# Altium schematic sheet Sheet2.SchDoc
size A3
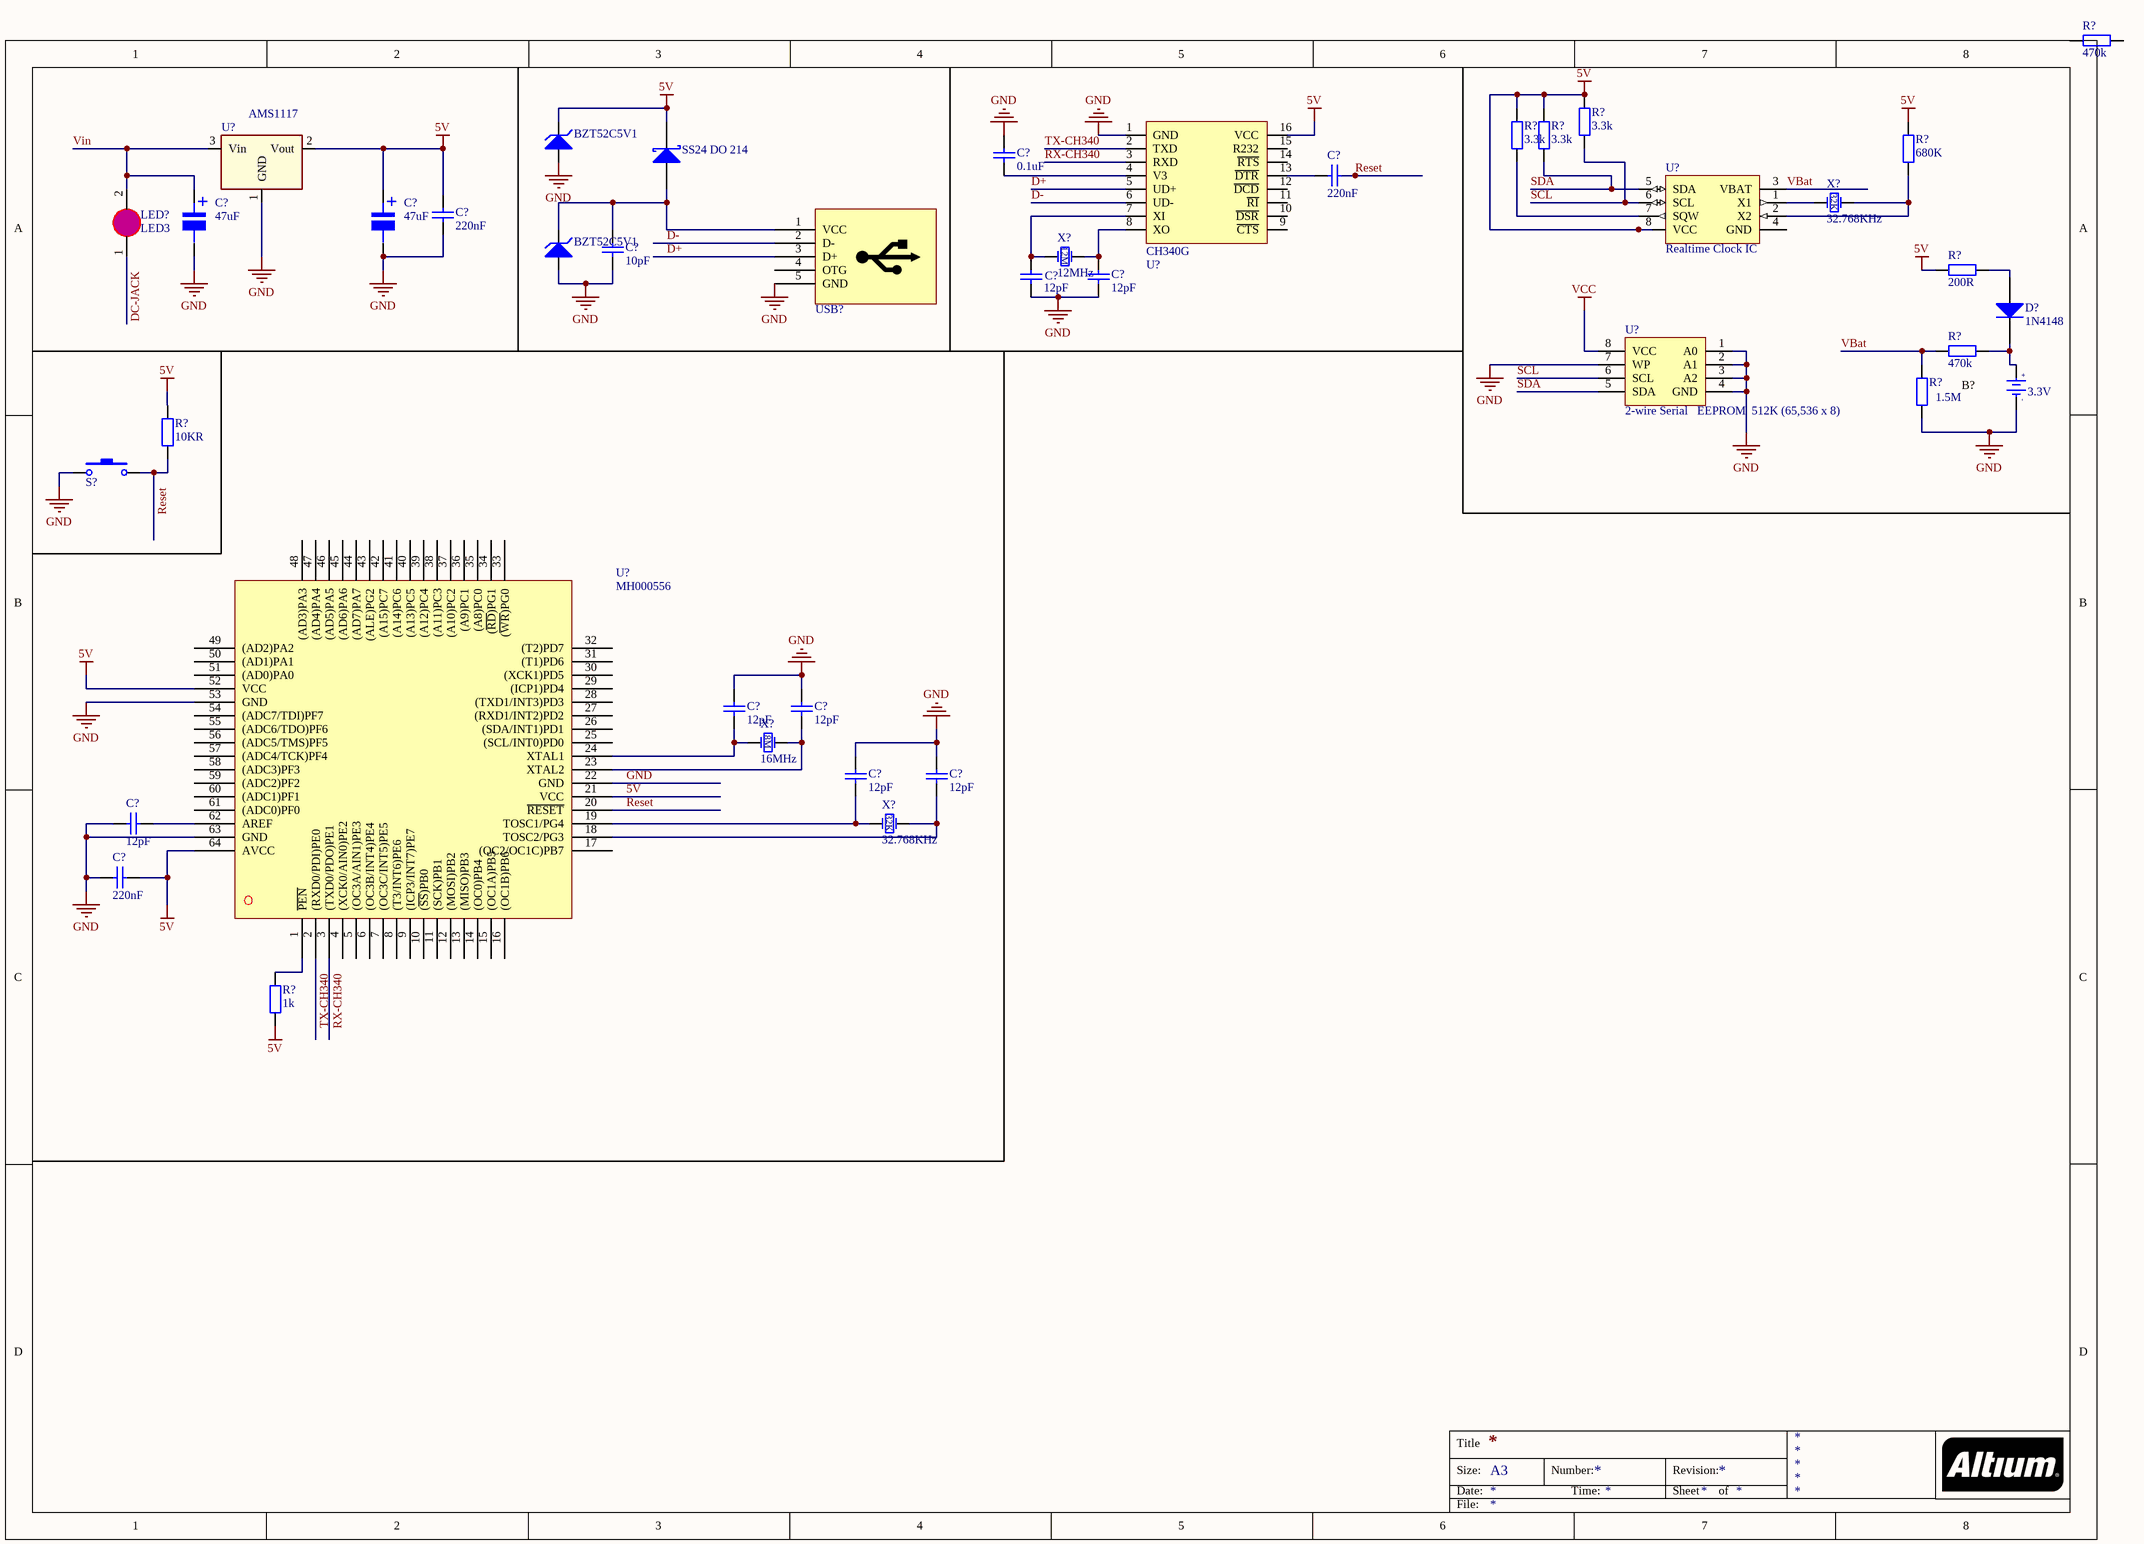
[diagram p0: Sheet2.SchDoc]

## Parts
(Parts that share a designator on the sheet are numbered #1, #2 ... from top to bottom, then left to right.)
B?  value 3.3V  [CR1220]  (hidden comment: BATT-Holder)
BZT52C5V1#1  5.6V/500mW  [DIODE_SOD-123]  (value not drawn)
BZT52C5V1#2  5.6V/500mW  [DIODE_SOD-123]  (value not drawn)
C?#1  0.1uF  [Tu 0805]
C?#2  220nF  [tu 0805]
C?#3  47uF  [tu nhom 6.3 (d)]
C?#4  47uF  [tu nhom 6.3 (d)]
C?#5  220nF  [tu 0805]
C?#6  10pF  [tu 0805]
C?#7  12pF  [Tu 0805]
C?#8  12pF  [Tu 0805]
C?#9  12pF  [Tu 0805]
C?#10  12pF  [Tu 0805]
C?#11  12pF  [Tu 0805]
C?#12  12pF  [Tu 0805]
C?#13  12pF  [Tu 0805]
C?#14  220nF  [tu 0805]
D?  1N4148  [SOD-123]
LED?  LED3  [LED0805]
R?#1  470k  [Tro SMD 0805]
R?#2  3.3k  [tro smd 0805]
R?#3  3.3k  [tro smd 0805]
R?#4  3.3k  [tro smd 0805]
R?#5  680K  [tro smd 0805]
R?#6  200R  [tro smd 0805]
R?#7  470k  [Tro SMD 0805]
R?#8  1.5M  [Tro SMD 0805]
R?#9  10KR  [tro smd 0805]
R?#10  1k  [tro smd 0805]
S?  MH001036  [SW-SMD]  (value not drawn)
SS24_DO_214  60V/1A  [DIODE_DO214AC_SMA]  (value not drawn)
U?#1  CH340G  [SO-16]  (value not drawn)
U?#2  AMS1117  [SOT223]
U?#3  Realtime Clock IC  [SOIC8]
U?#4  2-wire Serial   EEPROM  512K (65,536 x 8)  [SOIC8]
U?#5  MH000556  [MEGA128L]
USB?  MiniUSB 5P SMD  [USB-B-Mini]  (value not drawn)
X?#1  32.768KHz  [Crystal_ABS07_SMD-3.2x1.5MM]
X?#2  12MHz  [CRYSTAL_ABM3 5x3.2mm]
X?#3  16MHz  [CRYSTAL_ABM3 5x3.2mm]
X?#4  32.768KHz  [Crystal_ABS07_SMD-3.2x1.5MM]

## Nets
5V: BZT52C5V1#1.2(K) C?#4.1 C?#5.1 C?#14.1 R?#2.2 R?#3.2 R?#4.2 R?#5.2 R?#6.1 R?#9.2 R?#10.1 SS24_DO_214.2(K) U?#1.16(VCC) U?#2.2(Vout) U?#3.8(VCC) U?#5.21(VCC) U?#5.52(VCC) U?#5.64(AVCC)
GND: B?.2(-) BZT52C5V1#1.1(A) BZT52C5V1#2.1(A) C?#1.1 C?#3.2 C?#4.2 C?#5.2 C?#6.2 C?#7.2 C?#8.2 C?#9.1 C?#10.1 C?#11.1 C?#12.1 C?#13.1 C?#14.2 R?#8.1 S?.1 U?#1.1(GND) U?#2.1(GND) U?#4.1(A0) U?#4.2(A1) U?#4.3(A2) U?#4.4(GND) U?#4.7(WP) U?#5.22(GND) U?#5.53(GND) U?#5.63(GND) USB?.5(GND)
VCC: U?#4.8(VCC)
D+: U?#1.5(UD+) USB?.3(D+)
D-: U?#1.6(UD-) USB?.2(D-)
DC-JACK: LED?.1(A)
Reset: C?#2.1 R?#9.1 S?.2 U?#5.20(~{RESET})
RX-CH340: U?#1.3(RXD) U?#5.3((TXD0/PDO)PE1)
SCL: R?#2.1 U?#3.6(SCL) U?#4.6(SCL)
SDA: R?#4.1 U?#3.5(SDA) U?#4.5(SDA)
TX-CH340: U?#1.2(TXD) U?#5.2((RXD0/PDI)PE0)
VBat: R?#7.2 R?#8.2 U?#3.3(VBAT)
Vin: C?#3.1 LED?.2(K) U?#2.3(Vin)
NetB?_1: B?.1(+) D?.2(K) R?#7.1
NetBZT52C5V1#2_2: BZT52C5V1#2.2(K) C?#6.1 SS24_DO_214.1(A) USB?.1(VCC)
NetC?#1_2: C?#1.2 U?#1.4(V3)
NetC?#2_2: C?#2.2 U?#1.13(~{DTR})
NetC?#7_1: C?#7.1 U?#1.7(XI) X?#2.2(OSC2)
NetC?#8_1: C?#8.1 U?#1.8(XO) X?#2.1(OSC1)
NetC?#9_2: C?#9.2 U?#5.24(XTAL1) X?#3.2(OSC2)
NetC?#10_2: C?#10.2 U?#5.23(XTAL2) X?#3.1(OSC1)
NetC?#11_2: C?#11.2 U?#5.19(TOSC1/PG4) X?#4.2(OSC2)
NetC?#12_2: C?#12.2 U?#5.18(TOSC2/PG3) X?#4.1(OSC1)
NetC?#13_2: C?#13.2 U?#5.62(AREF)
NetD?_1: D?.1(A) R?#6.2
NetR?#3_1: R?#3.1 U?#3.7(SQW)
NetR?#5_1: R?#5.1 U?#3.2(X2) X?#1.1(OSC1)
NetR?#10_2: R?#10.2 U?#5.1(~{PEN})
NetU?#3_1: U?#3.1(X1) X?#1.2(OSC2)

Not connected (* = marked no-connect by the designer): R?#1 1 2; U?#1 9(~{CTS}) 10(~{DSR}) 11(~{RI}) 12(~{DCD}) 14(~{RTS}) 15(R232); U?#3 4(GND); U?#5 4((XCK0/AIN0)PE2) 5((OC3A/AIN1)PE3) 6((OC3B/INT4)PE4) 7((OC3C/INT5)PE5) 8((T3/INT6)PE6) 9((ICP3/INT7)PE7) 10((~{SS})PB0) 11((SCK)PB1) 12((MOSI)PB2) 13((MISO)PB3) 14((OC0)PB4) 15((OC1A)PB5) 16((OC1B)PB6) 17((OC2/OC1C)PB7) 25((SCL/INT0)PD0) 26((SDA/INT1)PD1) 27((RXD1/INT2)PD2) 28((TXD1/INT3)PD3) 29((ICP1)PD4) 30((XCK1)PD5) 31((T1)PD6) 32((T2)PD7) 33((~{WR})PG0) 34((~{RD})PG1) 35((A8)PC0) 36((A9)PC1) 37((A10)PC2) 38((A11)PC3) 39((A12)PC4) 40((A13)PC5) 41((A14)PC6) 42((A15)PC7) 43((ALE)PG2) 44((AD7)PA7) 45((AD6)PA6) 46((AD5)PA5) 47((AD4)PA4) 48((AD3)PA3) 49((AD2)PA2) 50((AD1)PA1) 51((AD0)PA0) 54((ADC7/TDI)PF7) 55((ADC6/TDO)PF6) 56((ADC5/TMS)PF5) 57((ADC4/TCK)PF4) 58((ADC3)PF3) 59((ADC2)PF2) 60((ADC1)PF1) 61((ADC0)PF0); USB? 4(OTG)

## Notes on the sheet
- Title
- Size:
- Date:
- A3
- Number:
- Time:
- Revision:
- Sheet
- of
- File:
- (in symbol ABM3-8.000MHZ-D2Y-T) 8M
- (in symbol ABM3-12.000MHZ-D2Y-T) 12M
- (in symbol ABS07-32.768KHZ-T) 32K
- (in symbol Tu Nhom 47uF 25V) +

## Library data of the parts
B? = BATT-Holder: Battery holder; Designed By: John MacTavish; Vendor: Digikey; ComponentLink1Description: Digikey Part Link; ComponentLink2Description: Open Datasheet
BZT52C5V1#1 BZT52C5V1#2 = NZH5V6B,115: BZT52C5V1; Solder: SMT; Value: 5.6V/500mW; MPN: NZH5V6B,115
C?#1 C?#7-C?#13 = Tu 102: Dán; Ten_Linh_Kien: Tụ 0805 102-1nF 10% 50V; Ma_Hang: MH004549; Don_Vi: Con; Kieu_Chan: *; Ghi_Chu: *; Chung_Loai: Dán
C?#2 C?#5 C?#14 = Tu 0805 220nF 50V 10%: Dán; Don_Vi: Con; So_Chan: 2; Ten_Linh_Kien: Tụ 0805 220nF 50V 10%; Ma_Hang: MH008099; Chung_Loai: Dán; Kieu_Chan: *
C?#3 C?#4 = Tu Nhom 47uF 25V: Dán; Don_Vi: Con; So_Chan: 2; Ten_Linh_Kien: Tụ Nhôm 47uF 25V 6.3x5.5MM; Ma_Hang: MH002216; Chung_Loai: Dán; Kieu_Chan: *
C?#6 = Tu 0805 10pF 50V 10%: Dán; Don_Vi: Con; So_Chan: 2; Ten_Linh_Kien: Tụ 0805 10P 10% 50V; Ma_Hang: MH004554; Chung_Loai: Dán; Kieu_Chan: *
D? = 1N4148-W-7: DIODE GEN PURP 100V 300MA SOD123; MPN: 1N4148W-7-F; MFR: Diodes Incorporated; Solder: SMT; Value: 100V/300MA
LED? = LEDSMD: LED 3mm
R?#1 R?#7 = Tro 0805 5% 470k: Dán; Don_Vi: Con; Ma_Hang: MH005340; So_Chan: 2; Ten_Linh_Kien: Trở 0805 5% 470k; Chung_Loai: Dán; Kieu_Chan: *
R?#2-R?#4 = Tro 0805 1% 3.3k: Dán; Don_Vi: Con; So_Chan: 2; Ten_Linh_Kien: Trở 0805 1% 3.3k; Ma_Hang: MH005472; Chung_Loai: Dán; Kieu_Chan: *
R?#5 = Tro 0805 1% 680R: Dán; Don_Vi: Con; So_Chan: 2; Ten_Linh_Kien: Trở 0805 1% 680R; Ma_Hang: MH005487; Chung_Loai: Dán; Kieu_Chan: *
R?#6 = Tro 0805 5% 200R: Dán; Don_Vi: Con; So_Chan: 2; Ten_Linh_Kien: Trở 0805 5% 200R; Ma_Hang: MH005257; Chung_Loai: Dán; Kieu_Chan: *
R?#8 = Tro 0805 5% 820k: Dán; Don_Vi: Con; Ma_Hang: MH005345; So_Chan: 2; Ten_Linh_Kien: Trở 0805 5% 820k; Chung_Loai: Dán; Kieu_Chan: *
R?#9 = Tro 0805 1% 0.22R: Dán; Don_Vi: Con; So_Chan: 2; Ten_Linh_Kien: Trở 0805 1% 0.22R; Ma_Hang: MH005466; Chung_Loai: Dán; Kieu_Chan: *
R?#10 = Tro 0805 1% 1k: Dán; Don_Vi: Con; So_Chan: 2; Ten_Linh_Kien: Trở 0805 1% 1k; Ma_Hang: MH005468; Chung_Loai: Dán; Kieu_Chan: *
S? = SW-SMD: Dán; Value: Nút Nhấn 2 Chân 3x6x2.5MM SMD
SS24_DO_214 = B160-13-F: DIODE SCHOTTKY 60V 1A SMA DO-214A; CompanyID: VT-00897; Solder: SMT; MPN: B160-13-F; Value: 60V/1A; MFR: *
U?#2 = AMS1117: Regulator SMD Chip; Designed By: John MacTavish; Vendor: Digikey; ComponentLink1Description: Digikey Part Link; ComponentLink2Description: Open Datasheet; ComponentLink2URL: H:\LIBRARY\LIBRARY.Datasheet\
U?#3 = DS1307: Manufacturer: Maxim; ComponentLink1Description: Digikey Part Link; ComponentLink2Description: Open Datasheet; ComponentLink2URL: H:\LIBRARY\LIBRARY.Datasheet\DS1307.pdf
U?#4 = EEPROM.24Cxxx: Manufacturer: Atmel; Value: 512Kb; ComponentLink2Description: Open datasheet; ComponentLink2URL: H:\LIBRARY\LIBRARY.Datasheet\24c512.pdf
U?#5 = Atmega128: Dán; Value: ATMEGA128A-AU TQFP64
USB? = USB_MINI: Dán; Ma_Hang: MH001022; Don_Vi: Con; Ten_Linh_Kien: MiniUSB 5P SMD; Kieu_Chan: *; Chung_Loai: Dán; Ghi_Chu: *
X?#1 X?#4 = ABS07-32.768KHZ-T: CRYSTAL 32.7680KHZ 12.5pF SMD; Solder: SMT; CompanyID: VT-01153; MPN: ABS07-32.768KHZ-T; Value: 32.768KHz; Category: CRYSTAL
X?#2 = ABM3-12.000MHZ-D2Y-T: CRYSTAL 12.0000MHZ 18pF SMD; Solder: SMT; CompanyID: VT-01247; MPN: ABM3-12.000MHZ-D2Y-T; Value: 12MHz; Category: CRYSTAL
X?#3 = ABM3-8.000MHZ-D2Y-T: CRYSTAL 8.0000MHZ 18pF SMD; Value: 8MHz; Solder: SMT; CompanyID: VT-00517; MPN: ABM3-8.000MHZ-D2Y-T; Category: CRYSTAL